# Altium schematic sheet NucleoBoard.SchDoc
size A
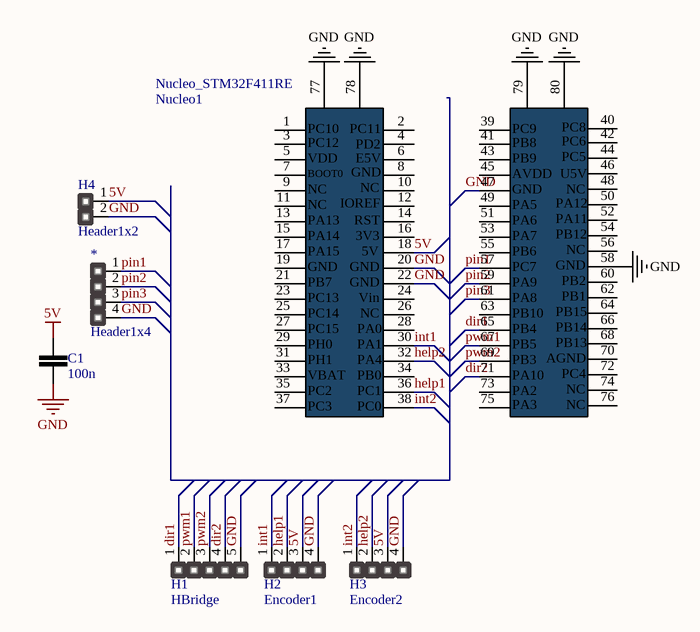
[diagram p0: NucleoBoard.SchDoc]

## Parts
*  Header1x4  [Header1x4]
C1  100n  [C1(ceramic)]
H1  HBridge  [Header1x5]
H2  Encoder1  [Header1x4]
H3  Encoder2  [Header1x4]
H4  Header1x2  [Header1x2]
Nucleo1  Nucleo_STM32F411RE  [Nucleo411]

## Nets
5V: C1.1 H2.3 H3.3 H4.1 Nucleo1.18
GND: *.4 C1.2 H1.5 H2.4 H3.4 H4.2 Nucleo1.20 Nucleo1.22 Nucleo1.47 Nucleo1.58 Nucleo1.77 Nucleo1.78 Nucleo1.79 Nucleo1.80
dir1: H1.1 Nucleo1.65
dir2: H1.4 Nucleo1.71
help1: H2.2 Nucleo1.36
help2: H3.2 Nucleo1.32
int1: H2.1 Nucleo1.30
int2: H3.1 Nucleo1.38
pin1: *.1 Nucleo1.57
pin2: *.2 Nucleo1.59
pin3: *.3 Nucleo1.61
pwm1: H1.2 Nucleo1.67
pwm2: H1.3 Nucleo1.69

Not connected (* = marked no-connect by the designer): Nucleo1 1 2 3(2) 4(3) 5(3) 6(4) 7(4) 8(5) 9(5) 10(6) 11(6) 12(7) 13(7) 14(8) 15(8) 16(9) 17(9) 19(10) 21(11) 23(12) 24(13) 25(13) 26(14) 27(14) 28(15) 29(15) 31(16) 33(17) 34(18) 35(18) 37(19) 39 40 41(40) 42(41) 43(41) 44(42) 45(42) 46(43) 48(44) 49(44) 50(45) 51(45) 52(46) 53(46) 54(47) 55(47) 56(48) 60(50) 62(51) 63(51) 64(52) 66(53) 68(54) 70(55) 72(56) 73(56) 74(57) 75(57) 76(58)

## Notes on the sheet
- (in symbol Nucleo_STM32F411RE) PC10; PC11; PC9; PC8; PC6; PC12; PD2; PB8; PC5; VDD; E5V; PB9; BOOT0; GND; AVDD; U5V; NC; IOREF; PA12; PA5; PA11; PA13; RST; PA6; PB12; PA14; 3V3; PA7; PA15; 5V; PB6; PC7; PB2; PB7; PA9; PB1; PC13; Vin; PA8; PB15; PC14; PB10; PB14; PC15; PA0; PB4; PB13; PH0; PA1; PB5; AGND; PH1; PA4; PB3; PC4; VBAT; PB0; PA10; PC2; PC1; PA2; PA3; PC3; PC0

## Library data of the parts
C1 = C1
H1 = Header1x5
H2 H3 = Header1x4